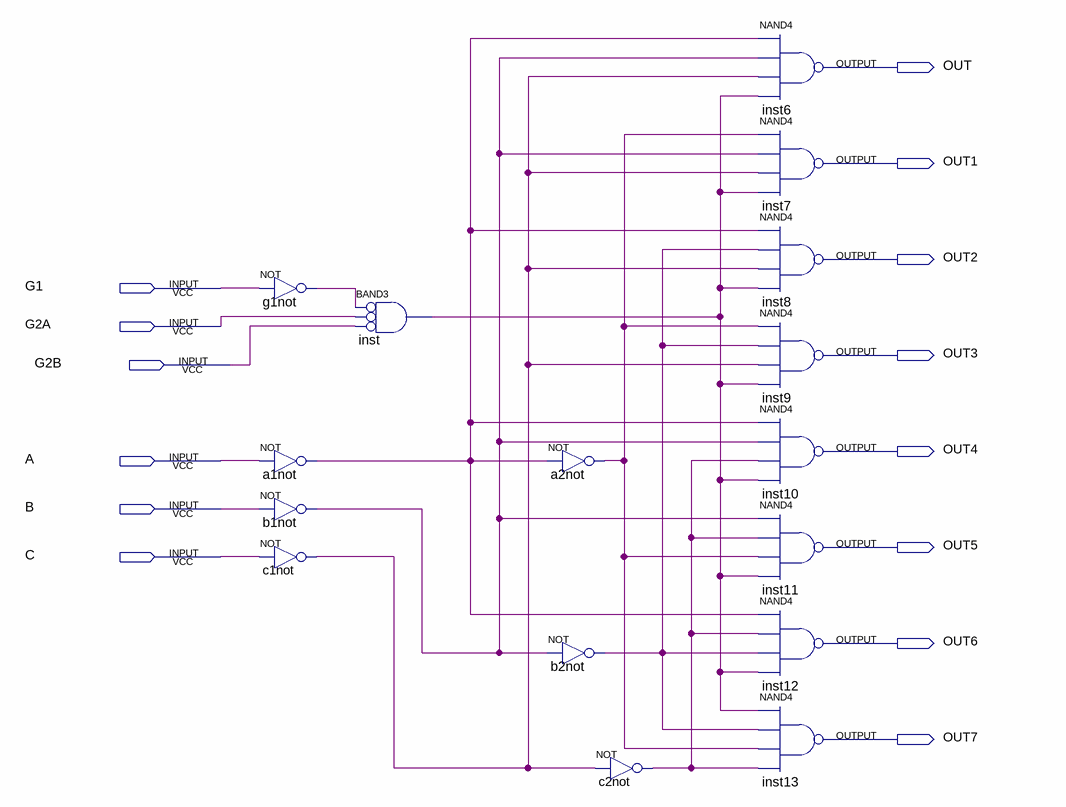
[diagram p0: schematic sheet]
// Quartus schematic Project.bdf as structural Verilog: 16 symbols, 14 pins
module Project (
  input  G1,
  input  G2A,
  input  G2B,
  input  A,
  input  B,
  input  C,
  output OUT,
  output OUT1,
  output OUT2,
  output OUT3,
  output OUT4,
  output OUT5,
  output OUT6,
  output OUT7
);

  wire a1not_out, a2not_out, b1not_out, b2not_out, c1not_out, c2not_out, g1not_out, inst_out;

  not g1not (g1not_out, G1);
  not a1not (a1not_out, A);
  not b1not (b1not_out, B);
  not c1not (c1not_out, C);
  and inst (inst_out, ~g1not_out, ~G2A, ~G2B);  // BAND3
  not a2not (a2not_out, a1not_out);
  not b2not (b2not_out, b1not_out);
  not c2not (c2not_out, c1not_out);
  nand inst6 (OUT, a1not_out, b1not_out, c1not_out, inst_out);
  nand inst7 (OUT1, a2not_out, b1not_out, c1not_out, inst_out);
  nand inst8 (OUT2, a1not_out, b2not_out, c1not_out, inst_out);
  nand inst9 (OUT3, a2not_out, b2not_out, c1not_out, inst_out);
  nand inst10 (OUT4, a1not_out, b1not_out, c2not_out, inst_out);
  nand inst11 (OUT5, b1not_out, c2not_out, a2not_out, inst_out);
  nand inst12 (OUT6, a1not_out, c2not_out, b2not_out, inst_out);
  nand inst13 (OUT7, inst_out, b2not_out, a2not_out, c2not_out);
endmodule
